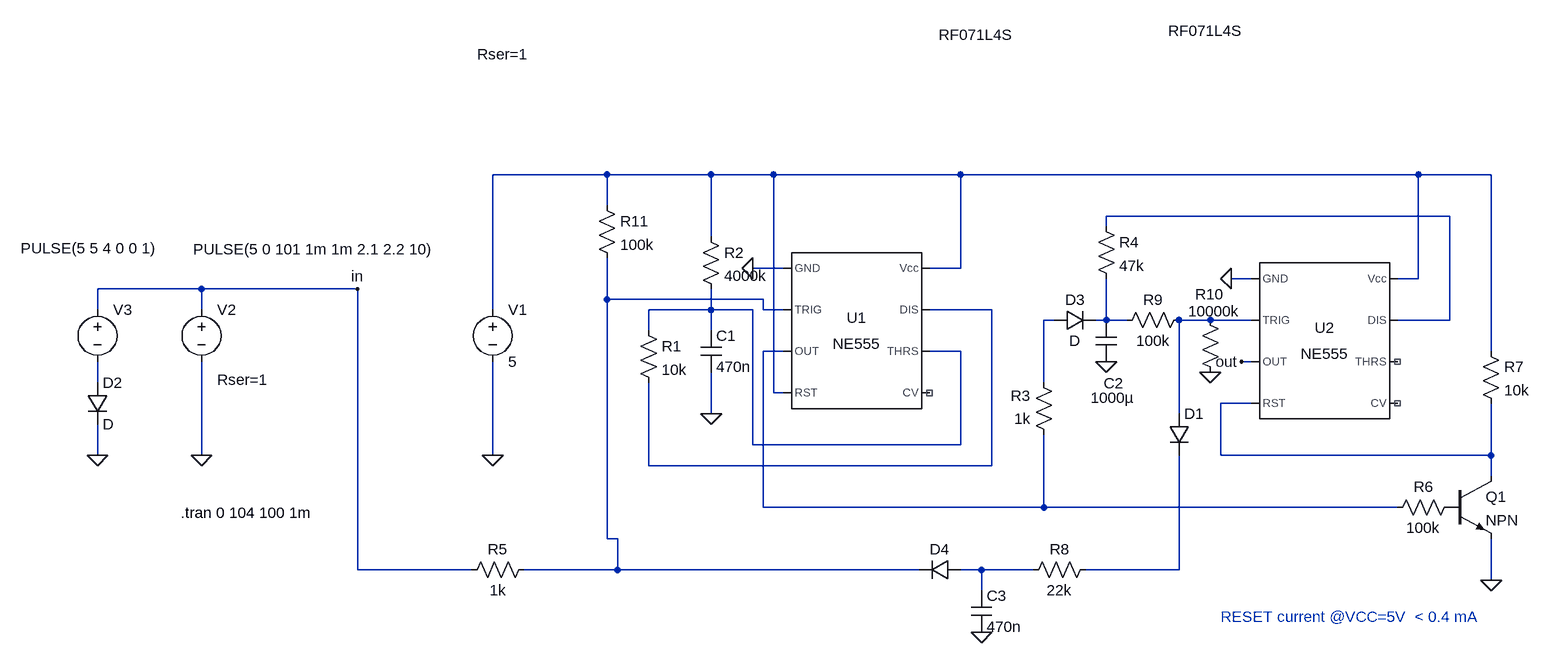
[diagram p0: schematic wylacznik_czasowy_do_swiatla_v3.asc]
wylacznik_czasowy_do_swiatla_v3.asc, the LTspice schematic file:
Version 4
SHEET 1 2180 680
WIRE 160 -64 -16 -64
WIRE 320 -64 160 -64
WIRE 416 -64 320 -64
WIRE 704 -64 416 -64
WIRE 1408 -64 704 -64
WIRE 1520 -64 1408 -64
WIRE 160 -16 160 -64
WIRE 1456 0 928 0
WIRE 928 16 928 0
WIRE 320 32 320 -64
WIRE 432 80 384 80
WIRE 704 80 704 -64
WIRE 704 80 656 80
WIRE 1152 96 1120 96
WIRE 1408 96 1408 -64
WIRE 1408 96 1376 96
WIRE -464 112 -624 112
WIRE -224 112 -464 112
WIRE 160 128 160 64
WIRE 400 128 160 128
WIRE -624 144 -624 112
WIRE -464 144 -464 112
WIRE -16 144 -16 -64
WIRE 320 144 320 112
WIRE 320 144 224 144
WIRE 384 144 320 144
WIRE 400 144 400 128
WIRE 432 144 400 144
WIRE 752 144 656 144
WIRE 848 160 832 160
WIRE 928 160 928 96
WIRE 928 160 912 160
WIRE 960 160 928 160
WIRE 1088 160 1040 160
WIRE 1152 160 1088 160
WIRE 1456 160 1456 0
WIRE 1456 160 1376 160
WIRE 224 176 224 144
WIRE 320 176 320 144
WIRE 432 208 400 208
WIRE 704 208 656 208
WIRE 1520 208 1520 -64
WIRE 1152 224 1136 224
WIRE -624 256 -624 224
WIRE 832 256 832 160
WIRE 416 272 416 -64
WIRE 432 272 416 272
WIRE 1152 288 1104 288
WIRE 320 304 320 240
WIRE 1040 304 1040 160
WIRE 384 352 384 144
WIRE 704 352 704 208
WIRE 704 352 384 352
WIRE -624 368 -624 320
WIRE -464 368 -464 224
WIRE -16 368 -16 224
WIRE 1104 368 1104 288
WIRE 1520 368 1520 288
WIRE 1520 368 1104 368
WIRE 224 384 224 256
WIRE 752 384 752 144
WIRE 752 384 224 384
WIRE 1520 400 1520 368
WIRE 400 448 400 208
WIRE 832 448 832 336
WIRE 832 448 400 448
WIRE 1376 448 832 448
WIRE 160 496 160 128
WIRE 176 496 160 496
WIRE -224 544 -224 112
WIRE -48 544 -224 544
WIRE 176 544 176 496
WIRE 176 544 32 544
WIRE 640 544 176 544
WIRE 736 544 704 544
WIRE 816 544 736 544
WIRE 1040 544 1040 368
WIRE 1040 544 896 544
WIRE 1520 560 1520 496
WIRE 736 576 736 544
FLAG -16 368 0
FLAG -464 368 0
FLAG -624 368 0
FLAG 320 304 0
FLAG 384 80 0
FLAG 1120 96 0
FLAG 928 224 0
FLAG 736 640 0
FLAG 1520 560 0
FLAG 1088 240 0
FLAG -224 112 in
FLAG 1136 224 out
SYMBOL voltage -16 128 R0
WINDOW 123 0 0 Left 0
WINDOW 39 -24 -377 Left 2
SYMATTR SpiceLine Rser=1
SYMATTR InstName V1
SYMATTR Value 5
SYMBOL Misc\\NE555 544 176 R0
SYMATTR InstName U1
SYMBOL voltage -464 128 R0
WINDOW 123 0 0 Left 0
WINDOW 39 24 124 Left 2
WINDOW 3 -13 -77 Left 2
SYMATTR SpiceLine Rser=1
SYMATTR InstName V2
SYMATTR Value PULSE(5 0 101 1m 1m 2.1 2.2 10)
SYMBOL voltage -624 128 R0
WINDOW 123 0 0 Left 0
WINDOW 39 0 0 Left 0
WINDOW 3 -118 -79 Left 2
SYMATTR InstName V3
SYMATTR Value PULSE(5 5 4 0 0 1)
SYMBOL diode -640 256 R0
SYMATTR InstName D2
SYMBOL cap 304 176 R0
SYMATTR InstName C1
SYMATTR Value 470n
SYMBOL res 208 160 R0
SYMATTR InstName R1
SYMATTR Value 10k
SYMBOL res 304 16 R0
SYMATTR InstName R2
SYMATTR Value 4000k
SYMBOL cap 912 160 R0
WINDOW 0 12 97 Left 2
WINDOW 3 -8 119 Left 2
SYMATTR InstName C2
SYMATTR Value 1000µ
SYMBOL res 912 0 R0
SYMATTR InstName R4
SYMATTR Value 47k
SYMBOL res 1472 432 R90
WINDOW 0 0 56 VBottom 2
WINDOW 3 32 56 VTop 2
SYMATTR InstName R6
SYMATTR Value 100k
SYMBOL diode 848 176 R270
WINDOW 0 32 32 VTop 2
WINDOW 3 0 32 VBottom 2
SYMATTR InstName D3
SYMBOL res 848 352 R180
WINDOW 0 36 76 Left 2
WINDOW 3 36 40 Left 2
SYMATTR InstName R3
SYMATTR Value 1k
SYMBOL res 1056 144 R90
WINDOW 0 0 56 VBottom 2
WINDOW 3 32 56 VTop 2
SYMATTR InstName R9
SYMATTR Value 100k
SYMBOL Misc\\NE555 1264 192 R0
SYMATTR InstName U2
SYMBOL npn 1456 400 R0
SYMATTR InstName Q1
SYMBOL res 1504 192 R0
SYMATTR InstName R7
SYMATTR Value 10k
SYMBOL cap 720 576 R0
SYMATTR InstName C3
SYMATTR Value 470n
SYMBOL diode 1024 304 R0
WINDOW 3 -1 -589 Left 2
SYMATTR InstName D1
SYMATTR Value RF071L4S
SYMBOL res 1072 144 R0
WINDOW 0 -7 -24 Left 2
WINDOW 3 -18 2 Left 2
SYMATTR InstName R10
SYMATTR Value 10000k
SYMBOL res 912 528 R90
WINDOW 0 0 56 VBottom 2
WINDOW 3 32 56 VTop 2
SYMATTR InstName R8
SYMATTR Value 22k
SYMBOL diode 704 528 R90
WINDOW 0 0 32 VBottom 2
WINDOW 3 -823 -24 VTop 2
SYMATTR InstName D4
SYMATTR Value RF071L4S
SYMBOL res 48 528 R90
WINDOW 0 0 56 VBottom 2
WINDOW 3 32 56 VTop 2
SYMATTR InstName R5
SYMATTR Value 1k
SYMBOL res 144 -32 R0
SYMATTR InstName R11
SYMATTR Value 100k
TEXT -496 456 Left 2 !.tran 0 104 100 1m
TEXT 1104 616 Left 2 ;RESET current @VCC=5V  < 0.4 mA

The netlist it stands for:
* wylacznik_czasowy_do_swiatla_v3.asc
V1 N001 0 5 Rser=1
XU1 0 N003 N009 N001 NC_01 N004 N005 N001 NE555  ; pins GND TRIG OUT RST CV THRS DIS Vcc
V2 in 0 PULSE(5 0 101 1m 1m 2.1 2.2 10) Rser=1
V3 in N010 PULSE(5 5 4 0 0 1)
D2 N010 0 D
C1 N004 0 470n
R1 N004 N005 10k
R2 N001 N004 4000k
C2 N007 0 1000µ
R4 N002 N007 47k
R6 P001 N009 100k
D3 N006 N007 D
R3 N009 N006 1k
R9 N008 N007 100k
XU2 0 N008 out N011 NC_02 NC_03 N002 N001 NE555  ; pins GND TRIG OUT RST CV THRS DIS Vcc
Q1 N011 P001 0 0 NPN
R7 N001 N011 10k
C3 N012 0 470n
D1 N008 N013 RF071L4S
R10 N008 0 10000k
R8 N013 N012 22k
D4 N012 N003 RF071L4S
R5 N003 in 1k
R11 N001 N003 100k
.model D D
.lib standard.dio
.model NPN NPN
.model PNP PNP
.lib standard.bjt
.tran 0 104 100 1m
* RESET current @VCC=5V  < 0.4 mA
.lib NE555.sub
.backanno
.end